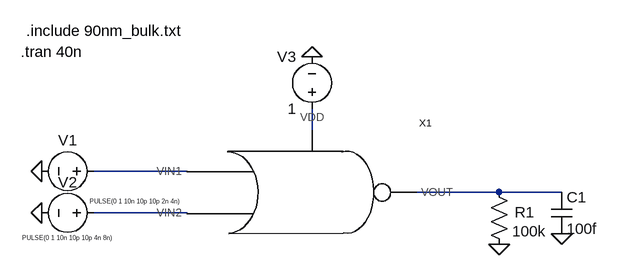
[diagram p0: schematic nortest.asc]
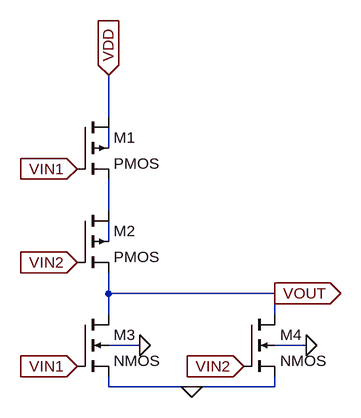
[diagram p1: sub-circuit nor.asc]
nortest.asc, the LTspice schematic file:
Version 4
SHEET 1 880 680
WIRE 384 160 384 128
WIRE 192 224 48 224
WIRE 672 256 544 256
WIRE 768 256 672 256
WIRE 192 288 48 288
FLAG 384 48 0
FLAG -32 224 0
FLAG -32 288 0
FLAG 768 320 0
FLAG 672 336 0
SYMBOL voltage 64 224 R90
WINDOW 0 -32 56 VBottom 2
WINDOW 3 46 -119 VRight 0
WINDOW 123 0 0 Left 0
WINDOW 39 0 0 Left 0
SYMATTR InstName V1
SYMATTR Value PULSE(0 1 10n 10p 10p 2n 4n)
SYMBOL voltage 64 288 R90
WINDOW 0 -32 56 VBottom 2
WINDOW 3 38 -15 VRight 0
WINDOW 123 0 0 Left 0
WINDOW 39 0 0 Left 0
SYMATTR InstName V2
SYMATTR Value PULSE(0 1 10n 10p 10p 4n 8n)
SYMBOL voltage 384 144 R180
WINDOW 0 24 96 Left 2
WINDOW 3 24 16 Left 2
WINDOW 123 0 0 Left 0
WINDOW 39 0 0 Left 0
SYMATTR InstName V3
SYMATTR Value 1
SYMBOL res 656 240 R0
WINDOW 0 40 47 Left 2
SYMATTR InstName R1
SYMATTR Value 100k
SYMBOL cap 752 256 R0
SYMATTR InstName C1
SYMATTR Value 100f
SYMBOL nor 384 256 R0
SYMATTR InstName X1
TEXT -64 40 Left 2 !.tran 40n
TEXT -56 8 Left 2 !.include 90nm_bulk.txt

nor.asc, the sub-circuit schematic file:
Version 4
SHEET 1 1100 680
WIRE 352 48 352 -16
WIRE 352 96 352 64
WIRE 352 192 352 144
WIRE 352 240 352 208
WIRE 352 320 352 288
WIRE 608 320 352 320
WIRE 352 352 352 320
WIRE 608 352 608 320
WIRE 400 400 352 400
WIRE 656 400 608 400
WIRE 352 464 352 448
WIRE 480 464 352 464
WIRE 608 464 608 448
WIRE 608 464 480 464
FLAG 304 128 VIN1
IOPIN 304 128 In
FLAG 304 272 VIN2
IOPIN 304 272 In
FLAG 352 -16 VDD
IOPIN 352 -16 In
FLAG 608 320 VOUT
IOPIN 608 320 Out
FLAG 400 400 0
FLAG 656 400 0
FLAG 480 464 0
FLAG 560 432 VIN2
IOPIN 560 432 In
FLAG 304 432 VIN1
IOPIN 304 432 In
SYMBOL pmos4 304 48 R0
SYMATTR InstName M1
SYMATTR Value2 l=90n w=400n
SYMBOL pmos4 304 192 R0
SYMATTR InstName M2
SYMATTR Value2 l=90n w=400n
SYMBOL nmos4 304 352 R0
SYMATTR InstName M3
SYMATTR Value2 l=90n w=200n
SYMBOL nmos4 560 352 R0
SYMATTR InstName M4
SYMATTR Value2 l=90n w=200n

The netlist it stands for:
* nortest.asc
V1 N002 0 PULSE(0 1 10n 10p 10p 2n 4n)
V2 N004 0 PULSE(0 1 10n 10p 10p 4n 8n)
V3 N001 0 1
R1 N003 0 100k
C1 N003 0 100f
XX1 N002 N004 N001 N003 nor

* block symbol definitions
.subckt nor VIN1 VIN2 VDD VOUT
M1 VDD VIN1 N002 N001 PMOS l=90n w=400n
M2 N002 VIN2 VOUT N003 PMOS l=90n w=400n
M3 VOUT VIN1 0 0 NMOS l=90n w=200n
M4 VOUT VIN2 0 0 NMOS l=90n w=200n
.ends nor

.model NMOS NMOS
.model PMOS PMOS
.lib standard.mos
.tran 40n
.include 90nm_bulk.txt
.backanno
.end